# Altium schematic sheet ft600hx4k.SchDoc
size A3
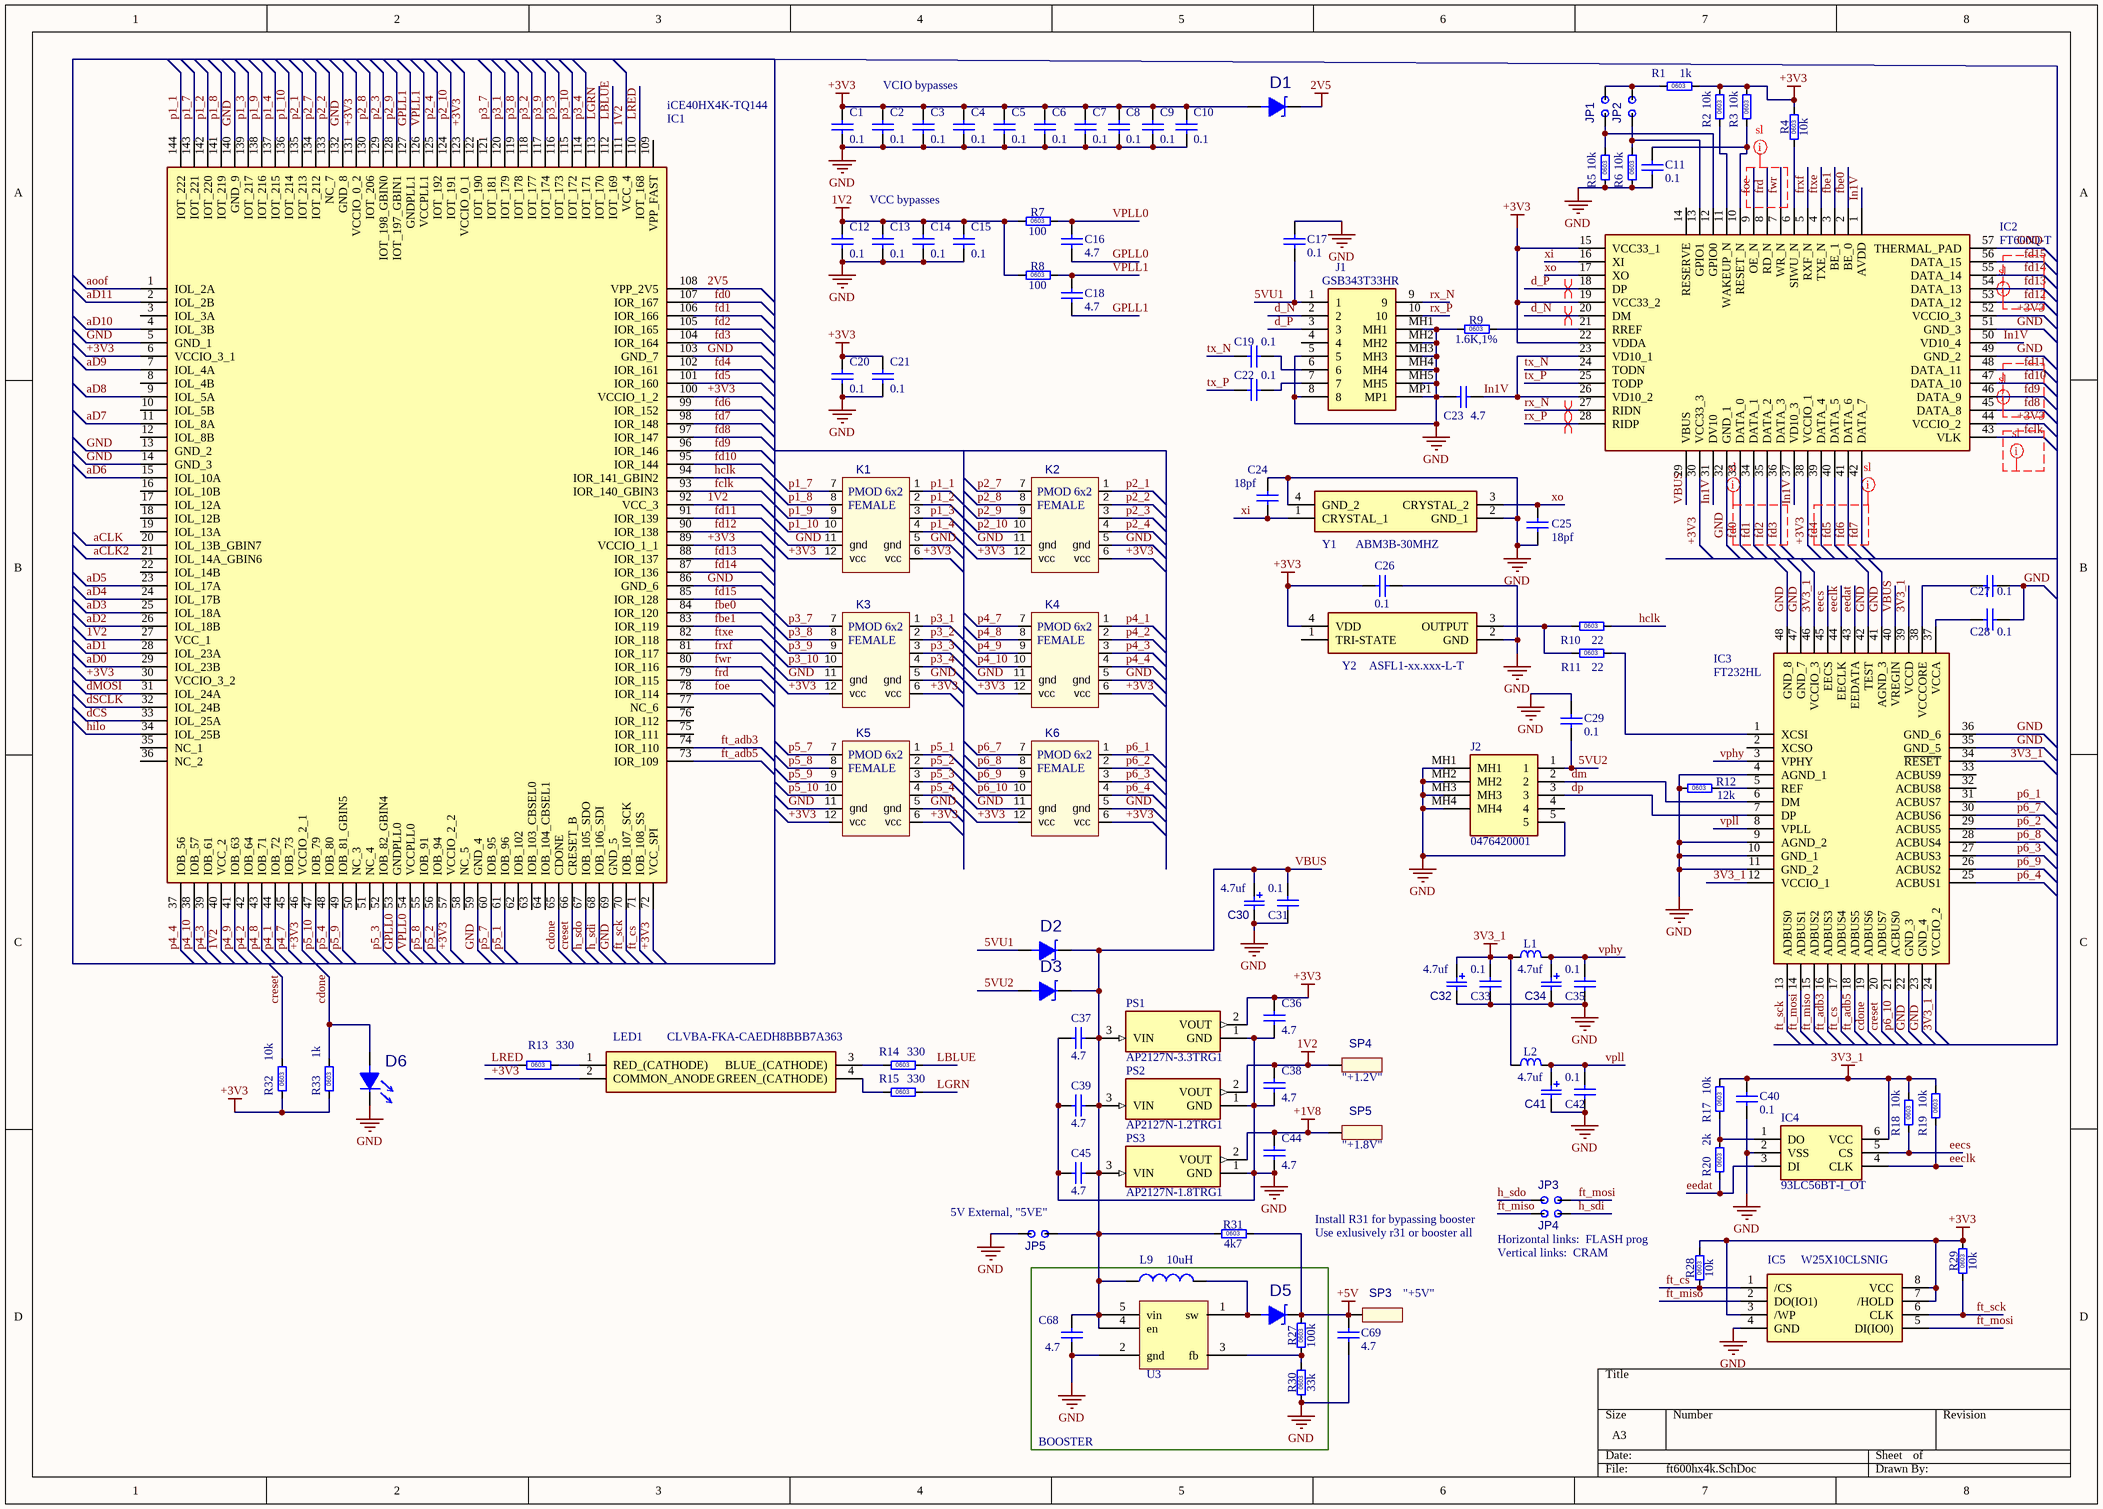
[diagram p0: ft600hx4k.SchDoc]

## Parts
C1  value 0.1  [SM0603 _3D_cap]  (hidden comment: cap0603)
C2  value 0.1  [SM0603 _3D_cap]  (hidden comment: cap0603)
C3  value 0.1  [SM0603 _3D_cap]  (hidden comment: cap0603)
C4  value 0.1  [SM0603 _3D_cap]  (hidden comment: cap0603)
C5  value 0.1  [SM0603 _3D_cap]  (hidden comment: cap0603)
C6  value 0.1  [SM0603 _3D_cap]  (hidden comment: cap0603)
C7  value 0.1  [SM0603 _3D_cap]  (hidden comment: cap0603)
C8  value 0.1  [SM0603 _3D_cap]  (hidden comment: cap0603)
C9  value 0.1  [SM0603 _3D_cap]  (hidden comment: cap0603)
C10  value 0.1  [SM0603 _3D_cap]  (hidden comment: cap0603)
C11  value 0.1  [SM0603 _3D_cap]  (hidden comment: cap0603)
C12  value 0.1  [SM0603 _3D_cap]  (hidden comment: cap0603)
C13  value 0.1  [SM0603 _3D_cap]  (hidden comment: cap0603)
C14  value 0.1  [SM0603 _3D_cap]  (hidden comment: cap0603)
C15  value 0.1  [SM0603 _3D_cap]  (hidden comment: cap0603)
C16  value 4.7  [SM0603 _3D_cap]  (hidden comment: cap0603)
C17  value 0.1  [SM0603 _3D_cap]  (hidden comment: cap0603)
C18  value 4.7  [SM0603 _3D_cap]  (hidden comment: cap0603)
C19  value 0.1  [SM0603 _3D_cap]  (hidden comment: cap0603)
C20  value 0.1  [SM0603 _3D_cap]  (hidden comment: cap0603)
C21  value 0.1  [SM0603 _3D_cap]  (hidden comment: cap0603)
C22  value 0.1  [SM0603 _3D_cap]  (hidden comment: cap0603)
C23  value 4.7  [SM0603 _3D_cap]  (hidden comment: cap0603)
C24  value 18pf  [SM0603 _3D_cap]  (hidden comment: cap0603)
C25  value 18pf  [SM0603 _3D_cap]  (hidden comment: cap0603)
C26  value 0.1  [SM0603 _3D_cap]  (hidden comment: cap0603)
C27  value 0.1  [SM0603 _3D_cap]  (hidden comment: cap0603)
C28  value 0.1  [SM0603 _3D_cap]  (hidden comment: cap0603)
C29  value 0.1  [SM0603 _3D_cap]  (hidden comment: cap0603)
C30  CAP_POL_SMA  [CAP_POL_SMA (3216)]  (value not drawn)
C31  value 0.1  [SM0603 _3D_cap]  (hidden comment: cap0603)
C32  CAP_POL_SMA  [CAP_POL_SMA (3216)]  (value not drawn)
C33  value 0.1  [SM0603 _3D_cap]  (hidden comment: cap0603)
C34  CAP_POL_SMA  [CAP_POL_SMA (3216)]  (value not drawn)
C35  value 0.1  [SM0603 _3D_cap]  (hidden comment: cap0603)
C36  value 4.7  [SM0603 _3D_cap]  (hidden comment: cap0603)
C37  value 4.7  [SM0603 _3D_cap]  (hidden comment: cap0603)
C38  value 4.7  [SM0603 _3D_cap]  (hidden comment: cap0603)
C39  value 4.7  [SM0603 _3D_cap]  (hidden comment: cap0603)
C40  value 0.1  [SM0603 _3D_cap]  (hidden comment: cap0603)
C41  CAP_POL_SMA  [CAP_POL_SMA (3216)]  (value not drawn)
C42  value 0.1  [SM0603 _3D_cap]  (hidden comment: cap0603)
C44  value 4.7  [SM0603 _3D_cap]  (hidden comment: cap0603)
C45  value 4.7  [SM0603 _3D_cap]  (hidden comment: cap0603)
C68  value 4.7  [SM0603 _3D_cap]  (hidden comment: cap0603)
C69  value 4.7  [SM0603 _3D_cap]  (hidden comment: cap0603)
D1  DiodeShottky_SOD323  [SOD323]  (value not drawn)
D2  DiodeShottky_SOD323  [SOD323]  (value not drawn)
D3  DiodeShottky_SOD323  [SOD323]  (value not drawn)
D5  DiodeShottky_SOD323  [SOD323]  (value not drawn)
D6  LIGHT_SM0805  [SM0805_diode]  (value not drawn)
IC1  iCE40HX4K-TQ144  [QFP50P2200X2200X160-144N]
IC2  FT600Q-T  [QFN40P700X700X90-57N-D]
IC3  FT232HL  [QFP50P900X900X160-48N]
IC4  93LC56BT-I_OT  [SOT95P270X145-6N]
IC5  W25X10CLSNIG  [SOIC127P600X175-8N]
J1  GSB343T33HR  [GSB343T33HR]
J2  0476420001  [0476420001]
JP1  JUMPER2  [JUMPER2]  (value not drawn)
JP2  JUMPER2  [JUMPER2]  (value not drawn)
JP3  JUMPER2  [JUMPER2]  (value not drawn)
JP4  JUMPER2  [JUMPER2]  (value not drawn)
JP5  JUMPER2  [JUMPER2]  (value not drawn)
K1  PMOD_6x2_ra_female  [PMOD_6x2_RA_FEMALE]  (value not drawn)
K2  PMOD_6x2_ra_female  [PMOD_6x2_RA_FEMALE]  (value not drawn)
K3  PMOD_6x2_ra_female  [PMOD_6x2_RA_FEMALE]  (value not drawn)
K4  PMOD_6x2_ra_female  [PMOD_6x2_RA_FEMALE]  (value not drawn)
K5  PMOD_6x2_ra_female  [PMOD_6x2_RA_FEMALE]  (value not drawn)
K6  PMOD_6x2_ra_female  [PMOD_6x2_RA_FEMALE]  (value not drawn)
L1  75R@100MHz  [SM0603_3D_res]  (value not drawn)
L2  75R@100MHz  [SM0603_3D_res]  (value not drawn)
L9  inductance SMT 3.2x4.5 mm  [inductor_LQH43PN]  (value not drawn)
LED1  CLVBA-FKA-CAEDH8BBB7A363  [CLVBAFKACAEDH8BBB7A363]
PS1  AP2127N-3.3TRG1  [SOT89P240X110-3N]
PS2  AP2127N-1.2TRG1  [SOT89P240X110-3N]
PS3  AP2127N-1.8TRG1  [SOT89P240X110-3N]
R1  1k  [SM0603_3D_res]
R2  10k  [SM0603_3D_res]
R3  10k  [SM0603_3D_res]
R4  10k  [SM0603_3D_res]
R5  10k  [SM0603_3D_res]
R6  10k  [SM0603_3D_res]
R7  100  [SM0603_3D_res]
R8  100  [SM0603_3D_res]
R9  1.6K,1%  [SM0603_3D_res]
R10  22  [SM0603_3D_res]
R11  22  [SM0603_3D_res]
R12  12k  [SM0603_3D_res]
R13  330  [SM0603_3D_res]
R14  330  [SM0603_3D_res]
R15  330  [SM0603_3D_res]
R17  10k  [SM0603_3D_res]
R18  10k  [SM0603_3D_res]
R19  10k  [SM0603_3D_res]
R20  2k  [SM0603_3D_res]
R27  100k  [SM0603_3D_res]
R28  10k  [SM0603_3D_res]
R29  10k  [SM0603_3D_res]
R30  33k  [SM0603_3D_res]
R31  4k7  [SM0603_3D_res]
R32  10k  [SM0603_3D_res]
R33  1k  [SM0603_3D_res]
SP3  value "+5V"  [SolderPad_D1mm _round]  (hidden comment: SolderPad D1mm_round)
SP4  value "+1.2V"  [SolderPad_D1mm _round]  (hidden comment: SolderPad D1mm_round)
SP5  value "+1.8V"  [SolderPad_D1mm _round]  (hidden comment: SolderPad D1mm_round)
U3  step up sot23-5  [SOT-23_5]  (value not drawn)
Y1  ABM3B-30MHZ  [ABM3B]
Y2  ASFL1-xx.xxx-L-T  [ASFL125000MHZLT]

## Blocks framed on the sheet
BOOSTER: C68 D5 L9 R27 R30 U3

## Nets
1V2: C12.2 C13.2 C14.2 C15.2 C38.1 IC1.27(VCC_1) IC1.40(VCC_2) IC1.92(VCC_3) IC1.111(VCC_4) PS2.2(VOUT) R7.1 R8.1 SP4.1
2V5: D1.2(k) IC1.108(VPP_2V5)
3V3_1: C32.1(a) C33.1 C40.2 IC3.12(VCCIO_1) IC3.24(VCCIO_2) IC3.34(~{RESET}) IC3.39(VCCD) IC3.46(VCCIO_3) IC4.6(VCC) L1.1 L2.1 R17.2 R18.2 R19.2
+1V8: C44.1 PS3.2(VOUT) SP5.1
+3V3: C1.2 C2.2 C3.2 C4.2 C5.2 C6.2 C7.2 C8.2 C9.2 C10.2 C20.2 C21.2 C26.1 C36.1 D1.1(a) IC1.6(VCCIO_3_1) IC1.30(VCCIO_3_2) IC1.46(VCCIO_2_1) IC1.57(VCCIO_2_2) IC1.72(VCC_SPI) IC1.89(VCCIO_1_1) IC1.100(VCCIO_1_2) IC1.123(VCCIO_0_1) IC1.131(VCCIO_0_2) IC2.15(VCC33_1) IC2.19(VCC33_2) IC2.22(VDDA) IC2.30(VCC33_3) IC2.38(VCCIO_1) IC2.44(VCCIO_2) IC2.52(VCCIO_3) IC5.3(/WP) IC5.7(/HOLD) IC5.8(VCC) K1.6(vcc) K1.12(vcc) K2.6(vcc) K2.12(vcc) K3.6(vcc) K3.12(vcc) K4.6(vcc) K4.12(vcc) K5.6(vcc) K5.12(vcc) K6.6(vcc) K6.12(vcc) LED1.2(COMMON_ANODE) PS1.2(VOUT) R1.2 R2.2 R3.2 R4.2 R28.2 R29.2 R32.1 R33.1 Y2.4(VDD)
+5V: C69.2 D5.2(k) R27.2 R31.2 SP3.1
GND: C1.1 C2.1 C3.1 C4.1 C5.1 C6.1 C7.1 C8.1 C9.1 C10.1 C11.2 C12.1 C13.1 C14.1 C15.1 C17.1 C20.1 C21.1 C23.2 C24.1 C25.2 C26.2 C27.2 C28.2 C29.1 C30.2(b) C31.2 C32.2(b) C33.2 C34.2(b) C35.2 C36.2 C37.2 C38.2 C39.1 C40.1 C41.2(b) C42.2 C44.2 C45.1 C68.1 C69.1 D6.2(k) IC1.5(GND_1) IC1.13(GND_2) IC1.14(GND_3) IC1.59(GND_4) IC1.69(GND_5) IC1.86(GND_6) IC1.103(GND_7) IC1.132(GND_8) IC1.140(GND_9) IC2.32(GND_1) IC2.49(GND_2) IC2.51(GND_3) IC2.57(THERMAL_PAD) IC3.4(AGND_1) IC3.9(AGND_2) IC3.10(GND_1) IC3.11(GND_2) IC3.22(GND_3) IC3.23(GND_4) IC3.35(GND_5) IC3.36(GND_6) IC3.41(AGND_3) IC3.42(TEST) IC3.47(GND_7) IC3.48(GND_8) IC4.2(VSS) IC5.4(GND) J1.5 J1.8 J1.MH1 J1.MH2 J1.MH3 J1.MH4 J1.MH5 J1.MP1 J2.5 J2.MH1 J2.MH2 J2.MH3 J2.MH4 JP5.2 K1.5(gnd) K1.11(gnd) K2.5(gnd) K2.11(gnd) K3.5(gnd) K3.11(gnd) K4.5(gnd) K4.11(gnd) K5.5(gnd) K5.11(gnd) K6.5(gnd) K6.11(gnd) PS1.1(GND) PS2.1(GND) PS3.1(GND) R5.1 R6.1 R9.1 R12.1 R30.1 U3.2(gnd) Y1.2(GND_1) Y1.4(GND_2) Y2.2(GND)
5VU1: C17.2 D2.1(a) J1.1
5VU2: C29.2 D3.1(a) J2.1
aCLK: IC1.20(IOL_13B_GBIN7)
aCLK2: IC1.21(IOL_14A_GBIN6)
aD0: IC1.29(IOL_23B)
aD1: IC1.28(IOL_23A)
aD2: IC1.26(IOL_18B)
aD3: IC1.25(IOL_18A)
aD4: IC1.24(IOL_17B)
aD5: IC1.23(IOL_17A)
aD6: IC1.15(IOL_10A)
aD7: IC1.11(IOL_8A)
aD8: IC1.9(IOL_5A)
aD9: IC1.7(IOL_4A)
aD10: IC1.4(IOL_3B)
aD11: IC1.2(IOL_2B)
aoof: IC1.1(IOL_2A)
cdone: D6.1(a) IC1.65(CDONE) IC3.19(ADBUS6) R33.2
creset: IC1.66(CRESET_B) IC3.20(ADBUS7) R32.2
d_N: IC2.20(DM) J1.2
d_P: IC2.18(DP) J1.3
dCS: IC1.33(IOL_25A)
dm: IC3.6(DM) J2.2
dMOSI: IC1.31(IOL_24A)
dp: IC3.7(DP) J2.3
dSCLK: IC1.32(IOL_24B)
eeclk: IC3.44(EECLK) IC4.4(CLK) R19.1
eecs: IC3.45(EECS) IC4.5(CS) R18.1
eedat: IC3.43(EEDATA) IC4.3(DI) R20.1
fbe0: IC1.84(IOR_120) IC2.2(BE_0)
fbe1: IC1.83(IOR_119) IC2.3(BE_1)
fclk: IC1.93(IOR_140_GBIN3) IC2.43(VLK)
fd0: IC1.107(IOR_167) IC2.33(DATA_0)
fd1: IC1.106(IOR_166) IC2.34(DATA_1)
fd2: IC1.105(IOR_165) IC2.35(DATA_2)
fd3: IC1.104(IOR_164) IC2.36(DATA_3)
fd4: IC1.102(IOR_161) IC2.39(DATA_4)
fd5: IC1.101(IOR_160) IC2.40(DATA_5)
fd6: IC1.99(IOR_152) IC2.41(DATA_6)
fd7: IC1.98(IOR_148) IC2.42(DATA_7)
fd8: IC1.97(IOR_147) IC2.45(DATA_8)
fd9: IC1.96(IOR_146) IC2.46(DATA_9)
fd10: IC1.95(IOR_144) IC2.47(DATA_10)
fd11: IC1.91(IOR_139) IC2.48(DATA_11)
fd12: IC1.90(IOR_138) IC2.53(DATA_12)
fd13: IC1.88(IOR_137) IC2.54(DATA_13)
fd14: IC1.87(IOR_136) IC2.55(DATA_14)
fd15: IC1.85(IOR_128) IC2.56(DATA_15)
foe: IC1.78(IOR_114) IC2.9(OE_N)
frd: IC1.79(IOR_115) IC2.8(RD_N)
frxf: IC1.81(IOR_117) IC2.5(RXF_N)
ft_adb3: IC1.74(IOR_110) IC3.16(ADBUS3)
ft_adb5: IC1.73(IOR_109) IC3.18(ADBUS5)
ft_cs: IC1.71(IOB_108_SS) IC3.17(ADBUS4) IC5.1(/CS) R28.1
ft_miso: IC3.15(ADBUS2) IC5.2(DO(IO1)) JP4.2
ft_mosi: IC3.14(ADBUS1) IC5.5(DI(IO0)) JP3.1
ft_sck: IC1.70(IOB_107_SCK) IC3.13(ADBUS0) IC5.6(CLK) R29.1
ftxe: IC1.82(IOR_118) IC2.4(TXE_N)
fwr: IC1.80(IOR_116) IC2.7(WR_N)
GPLL0: C16.2 IC1.53(GNDPLL0)
GPLL1: C18.2 IC1.127(GNDPLL1)
h_sdi: IC1.68(IOB_106_SDI) JP4.1
h_sdo: IC1.67(IOB_105_SDO) JP3.2
hclk: IC1.94(IOR_141_GBIN2) R10.2
hilo: IC1.34(IOL_25B)
In1V: C23.1 IC2.1(AVDD) IC2.23(VD10_1) IC2.26(VD10_2) IC2.31(DV10) IC2.37(VD10_3) IC2.50(VD10_4)
LBLUE: IC1.112(IOT_169) R14.2
LGRN: IC1.113(IOT_170) R15.2
LRED: IC1.110(IOT_168) R13.1
p1_1: IC1.144(IOT_222) K1.1
p1_2: IC1.142(IOT_220) K1.2
p1_3: IC1.139(IOT_217) K1.3
p1_4: IC1.137(IOT_215) K1.4
p1_7: IC1.143(IOT_221) K1.7
p1_8: IC1.141(IOT_219) K1.8
p1_9: IC1.138(IOT_216) K1.9
p1_10: IC1.136(IOT_214) K1.10
p2_1: IC1.135(IOT_213) K2.1
p2_2: IC1.133(NC_7) K2.2
p2_3: IC1.129(IOT_198_GBIN0) K2.3
p2_4: IC1.125(IOT_192) K2.4
p2_7: IC1.134(IOT_212) K2.7
p2_8: IC1.130(IOT_206) K2.8
p2_9: IC1.128(IOT_197_GBIN1) K2.9
p2_10: IC1.124(IOT_191) K2.10
p3_1: IC1.120(IOT_179) K3.1
p3_2: IC1.118(IOT_177) K3.2
p3_3: IC1.116(IOT_173) K3.3
p3_4: IC1.114(IOT_171) K3.4
p3_7: IC1.121(IOT_181) K3.7
p3_8: IC1.119(IOT_178) K3.8
p3_9: IC1.117(IOT_174) K3.9
p3_10: IC1.115(IOT_172) K3.10
p4_1: IC1.44(IOB_72) K4.1
p4_2: IC1.42(IOB_64) K4.2
p4_3: IC1.39(IOB_61) K4.3
p4_4: IC1.37(IOB_56) K4.4
p4_7: IC1.45(IOB_73) K4.7
p4_8: IC1.43(IOB_71) K4.8
p4_9: IC1.41(IOB_63) K4.9
p4_10: IC1.38(IOB_57) K4.10
p5_1: IC1.61(IOB_96) K5.1
p5_2: IC1.56(IOB_94) K5.2
p5_3: IC1.52(IOB_82_GBIN4) K5.3
p5_4: IC1.48(IOB_80) K5.4
p5_7: IC1.60(IOB_95) K5.7
p5_8: IC1.55(IOB_91) K5.8
p5_9: IC1.49(IOB_81_GBIN5) K5.9
p5_10: IC1.47(IOB_79) K5.10
p6_1: IC3.31(ACBUS7) K6.1
p6_2: IC3.29(ACBUS5) K6.2
p6_3: IC3.27(ACBUS3) K6.3
p6_4: IC3.25(ACBUS1) K6.4
p6_7: IC3.30(ACBUS6) K6.7
p6_8: IC3.28(ACBUS4) K6.8
p6_9: IC3.26(ACBUS2) K6.9
p6_10: IC3.21(ACBUS0) K6.10
rx_N: IC2.27(RIDN) J1.9
rx_P: IC2.28(RIDP) J1.10
tx_N: C19.2 IC2.24(TODN)
tx_P: C22.2 IC2.25(TODP)
VBUS: C30.1(a) C31.1 C37.1 C39.2 C45.2 C68.2 D2.2(k) D3.2(k) IC2.29(VBUS) IC3.40(VREGIN) JP5.1 L9.1 PS1.3(VIN) PS2.3(VIN) PS3.3(VIN) R31.1 U3.4(en) U3.5(vin)
vphy: C34.1(a) C35.1 IC3.3(VPHY) L1.2
vpll: C41.1(a) C42.1 IC3.8(VPLL) L2.2
VPLL0: C16.1 IC1.54(VCCPLL0) R7.2
VPLL1: C18.1 IC1.126(VCCPLL1) R8.2
xi: C24.2 IC2.16(XI) Y1.1(CRYSTAL_1)
xo: C25.1 IC2.17(XO) Y1.3(CRYSTAL_2)
NetC11_1: C11.1 IC2.10(RESET_N) R3.1
NetC19_1: C19.1 J1.6
NetC22_1: C22.1 J1.7
NetC27_1: C27.1 IC3.38(VCCCORE)
NetC28_1: C28.1 IC3.37(VCCA)
NetD5_1: D5.1(a) L9.2 U3.1(sw)
NetIC2_6: IC2.6(SIWU_N) R4.1
NetIC2_11: IC2.11(WAKEUP_N) R2.1
NetIC2_12: IC2.12(GPIO0) JP1.2 R5.2
NetIC2_13: IC2.13(GPIO1) JP2.2 R6.2
NetIC2_21: IC2.21(RREF) R9.2
NetIC3_1: IC3.1(XCSI) R11.2
NetIC3_5: IC3.5(REF) R12.2
NetIC4_1: IC4.1(DO) R17.1 R20.2
NetJP1_1: JP1.1 JP2.1 R1.1
NetLED1_1: LED1.1(RED_(CATHODE)) R13.2
NetLED1_3: LED1.3(BLUE_(CATHODE)) R14.1
NetLED1_4: LED1.4(GREEN_(CATHODE)) R15.1
NetR10_1: R10.1 R11.1 Y2.3(OUTPUT)
NetR27_1: R27.1 R30.2 U3.3(fb)

Not connected (* = marked no-connect by the designer): IC1 3(IOL_3A) 8(IOL_4B) 10(IOL_5B) 12(IOL_8B) 16(IOL_10B) 17(IOL_12A) 18(IOL_12B) 19(IOL_13A) 22(IOL_14B) 35(NC_1) 36(NC_2) 50(NC_3) 51(NC_4) 58(NC_5) 62(IOB_102) 63(IOB_103_CBSEL0) 64(IOB_104_CBSEL1) 75(IOR_111) 76(IOR_112) 77(NC_6) 109(VPP_FAST) 122(IOT_190); IC2 14(RESERVE); IC3 2(XCSO) 32(ACBUS8) 33(ACBUS9); J1 4; J2 4; Y2 1(TRI-STATE)

## Layout directives
differential pair: d_N, d_P, rx_N, rx_P
rule Matched Net Lengths [Tolerance = 20mil]; net class ft: fclk, fd0, fd1, fd2, fd3, fd4, fd5, fd6, fd7, fd8, fd9, fd10, fd11, fd12, fd13, fd14, fd15, foe, frd, fwr

## Notes on the sheet
- VCIO bypasses
- VCC bypasses
- (near JP5) 5V External, "5VE"
- Install R31 for bypassing booster
- Use exlusively r31 or booster all
- Horizontal links:  FLASH prog
- Vertical links:  CRAM
- (in symbol CAP_POL_SMA) 4.7uf
- (in symbol inductor_LQH43PN) 10uH
- (in symbol PMOD_6x2_ra_female) PMOD 6x2; FEMALE
- (in symbol Res_0603_EU) 0603

## Library data of the parts
C1-C29 C31 C33 C35-C40 C42 C44 C45 C68 C69 = cap0603: Capacitor  0603 inch; Published: 8-Jun-2000; LatestRevisionDate: 17-Jul-2002; LatestRevisionNote: Re-released for DXP Platform.; PackageReference: RAD-0.3; Publisher: Altium Limited; PackageDescription: Radial Cap, Thru-Hole; 2 Leads; 0.3 in Pin Spacing
C30 C32 C34 C41 = CAP_POL_SMA: CAP_POL_SMA(3216)
D1-D3 D5 = DiodeShottky_SOD323: SOD323
IC1 = iCE40HX4K-TQ144: Integrated Circuit; Manufacturer_Name: Lattice Semiconductor; Datasheet Link: https://componentsearchengine.com/Datasheets/1/iCE40HX4K-TQ144.pdf; Height: 1.6mm; Manufacturer_Part_Number: iCE40HX4K-TQ144; Mouser Part Number: 842-ICE40HX4K-TQ144; Mouser Price/Stock: https://www.mouser.co.uk/ProductDetail/Lattice/iCE40HX4K-TQ144?qs=F9A14TELRMvGNTZXkNDuOw%3D%3D; Arrow Part Number: ICE40HX4K-TQ144; Arrow Price/Stock: https://www.arrow.com/en/products/ice40hx4k-tq144/lattice-semiconductor
IC2 = FT600Q-T: Integrated Circuit; Manufacturer_Name: FTDI Chip; Datasheet Link: http://www.farnell.com/datasheets/1975744.pdf; Height: 0.9mm; Manufacturer_Part_Number: FT600Q-T; Mouser Part Number: 895-FT600Q-T; Mouser Price/Stock: https://www.mouser.com/Search/Refine.aspx?Keyword=895-FT600Q-T; Arrow Part Number: FT600Q-T; Arrow Price/Stock: https://www.arrow.com/en/products/ft600q-t/ftdi-chip
IC3 = FT232HL-REEL: Integrated Circuit; Manufacturer_Name: FTDI Chip; Datasheet Link: http://www.ftdichip.com/Support/Documents/DataSheets/ICs/DS_FT232H.pdf; Height: 1.6mm; Manufacturer_Part_Number: FT232HL-REEL; Mouser Part Number: 895-FT232HL-REEL; Mouser Price/Stock: https://www.mouser.co.uk/ProductDetail/FTDI/FT232HL-REEL/?qs=rzPzygjq8vIanTFlYsBQCw%3D%3D; Arrow Part Number: FT232HL-REEL; Arrow Price/Stock: https://www.arrow.com/en/products/ft232hl-reel/ftdi-chip
IC4 = 93LC56BT-I_OT: Integrated Circuit; Manufacturer_Name: Microchip; Manufacturer_Part_Number: 93LC56BT-I/OT; Datasheet Link: http://ww1.microchip.com/downloads/en/DeviceDoc/21794G.pdf; Height: 1.45mm; Mouser Part Number: 579-93LC56BT-I/OT; Mouser Price/Stock: https://www.mouser.co.uk/ProductDetail/Microchip-Technology/93LC56BT-I-OT?qs=lQv0JY93vrc7B5Rh5LPW8g%3D%3D; Arrow Part Number: 93LC56BT-I/OT; Arrow Price/Stock: https://www.arrow.com/en/products/93lc56bt-iot/microchip-technology?region=nac
IC5 = W25X10CLSNIG: Integrated Circuit; Manufacturer_Name: Winbond; Datasheet Link: https://www.arrow.com/en/products/w25x10clsnig/winbond-electronics; Height: 1.75mm; Manufacturer_Part_Number: W25X10CLSNIG; Mouser Part Number: 454-W25X10CLSNIG; Mouser Price/Stock: https://www.mouser.co.uk/ProductDetail/Winbond/W25X10CLSNIG?qs=qSfuJ%252Bfl%2Fd58%252Bc3wxS8Vmg%3D%3D; Arrow Part Number: W25X10CLSNIG; Arrow Price/Stock: https://www.arrow.com/en/products/w25x10clsnig/winbond-electronics
J1 = GSB343T33HR: Connector; Manufacturer_Name: Amphenol; Datasheet Link: https://componentsearchengine.com/Datasheets/2/GSB343T33HR.pdf; Height: 5.25mm; Manufacturer_Part_Number: GSB343T33HR; Mouser Part Number: 523-GSB343T33HR; Mouser Price/Stock: https://www.mouser.co.uk/ProductDetail/Amphenol-Commercial-Products/GSB343T33HR/?qs=8nwx9VzGl4wjI7K6xpTSyQ%3D%3D; Arrow Part Number: GSB343T33HR; Arrow Price/Stock: https://www.arrow.com/en/products/gsb343t33hr/amphenol
J2 = 0476420001: Connector; Manufacturer_Name: Molex; Datasheet Link: https://www.molex.com/pdm_docs/sd/476420001_sd.pdf; Height: 2.94mm; Manufacturer_Part_Number: 0476420001; Mouser Part Number: N/A; Mouser Price/Stock: https://www.mouser.com/Search/Refine.aspx?Keyword=N%2FA; Arrow Part Number: 0476420001; Arrow Price/Stock: https://www.arrow.com/en/products/0476420001/molex?region=nac
K1-K6 = PMOD_6x2_ra_female: PMOD_6x2_right_angle; Value: *
L1 L2 = chip inductance 0603: Part Number: IND0805_MURATA_BLM21BB750SN1D; Part Description: SMD EMIFIL Suppression Chip Ferrite Bead; Manufacturer: MURATA; Manufacturer Part Number: BLM21BB750SN1D; Power: 700mA; Resistance: 0.16R; Tolerance: ±25%; Table: Inductors SMD; Component Kind: Standard; Component Type: Standard; Footprint: INDC2012X105N; Pin Count: 2; Value: 75R@100MHz; Status: None; Case: 0805; Mounted: Yes; Socket: No; SMD: Yes; ComponentHeight: 1.05mm; Author: S. Jafar; CreateDate: 12/21/2015; LatestRevisionDate: 12/21/2015
L9 = inductor_LQH43PN
LED1 = CLVBA-FKA-CAEDH8BBB7A363: LED; Manufacturer_Name: Cree; Datasheet Link: http://www.cree.com/led-components/media/documents/ds-CLVBA-FKA.pdf; Height: 2.1mm; Manufacturer_Part_Number: CLVBA-FKA-CAEDH8BBB7A363; Mouser Part Number: 941-VBAFKACAEDH8B7A3; Mouser Price/Stock: https://www.mouser.co.uk/ProductDetail/Cree-Inc/CLVBA-FKA-CAEDH8BBB7a363/?qs=3AcK5DacLboXYkg4biCgSA%3D%3D; Arrow Part Number: CLVBA-FKA-CAEDH8BBB7A363; Arrow Price/Stock: https://www.arrow.com/en/products/clvba-fka-caedh8bbb7a363/cree
PS1-PS3 = AP2127N-3.3TRG1: Power Supply; Manufacturer_Name: Diodes Inc.; Datasheet Link: https://componentsearchengine.com/Datasheets/1/AP2127N-3.3TRG1.pdf; Height: 1.1mm; Manufacturer_Part_Number: AP2127N-3.3TRG1; Mouser Part Number: 621-AP2127N-3.3TRG1; Mouser Price/Stock: https://www.mouser.co.uk/ProductDetail/Diodes-Incorporated/AP2127N-33TRG1/?qs=x6A8l6qLYDCwIat%252BGHxAAg%3D%3D; Arrow Part Number: AP2127N-3.3TRG1; Arrow Price/Stock: https://www.arrow.com/en/products/ap2127n-3.3trg1/diodes-incorporated
R1-R8 R10-R15 R17-R20 R27-R30 R32 R33 = Res_0603_EU: Part Number: R1206_4K7_1%_0.25W_100PPM; Part Description: General Purpose Thick Film Chip Resistor; Manufacturer: GENERIC; Manufacturer1 Part Number: NRC12F4701TRF; Value: 4k7; Power: 0.25W; TC: ±100ppm/°C; Tolerance: ±1%; Table: Resistors SMD; Component Kind: Standard; Component Type: Standard; Footprint: RESC3216X65N; Pin Count: 2; Status: Preferred; Manufacturer Part Number: R1206_4K7_1%_0.25W_100PPM; Case: 1206; Mounted: Yes; Socket: No; SMD: Yes; Manufacturer1 Example: NIC COMPONENT; Manufacturer1 ComponentHeight: 0.65mm; HelpURL: \\cern.ch\dfs\Applications\Altium\Datasheets\R1206_NIC_NRC.pdf; Author: CERN DEM JLC; CreateDate: 12/3/2007; LatestRevisionDate: 3/13/2008
R9 = Res_0603_EU: Part Number: R1206_4K7_1%_0.25W_100PPM; Part Description: General Purpose Thick Film Chip Resistor; Manufacturer: GENERIC; Manufacturer1 Part Number: NRC12F4701TRF; Value: 4k7; Power: 0.25W; TC: ±100ppm/°C; Table: Resistors SMD; Component Kind: Standard; Component Type: Standard; Footprint: RESC3216X65N; Pin Count: 2; Status: Preferred; Tolerance: ±1%; Manufacturer Part Number: R1206_4K7_1%_0.25W_100PPM; Case: 1206; Mounted: Yes; Socket: No; SMD: Yes; Manufacturer1 Example: NIC COMPONENT; Manufacturer1 ComponentHeight: 0.65mm; HelpURL: \\cern.ch\dfs\Applications\Altium\Datasheets\R1206_NIC_NRC.pdf; Author: CERN DEM JLC; CreateDate: 12/3/2007; LatestRevisionDate: 3/13/2008
R31 = Res_0603_EU: Part Number: R1206_4K7_1%_0.25W_100PPM; Part Description: General Purpose Thick Film Chip Resistor; Manufacturer: GENERIC; Manufacturer1 Part Number: NRC12F4701TRF; Power: 0.25W; TC: ±100ppm/°C; Tolerance: ±1%; Table: Resistors SMD; Component Kind: Standard; Component Type: Standard; Footprint: RESC3216X65N; Pin Count: 2; Value: 4k7; Status: Preferred; Manufacturer Part Number: R1206_4K7_1%_0.25W_100PPM; Case: 1206; Mounted: Yes; Socket: No; SMD: Yes; Manufacturer1 Example: NIC COMPONENT; Manufacturer1 ComponentHeight: 0.65mm; HelpURL: \\cern.ch\dfs\Applications\Altium\Datasheets\R1206_NIC_NRC.pdf; Author: CERN DEM JLC; CreateDate: 12/3/2007; LatestRevisionDate: 3/13/2008
SP3-SP5 = SolderPad D1mm_round: for finger touch
U3 = TPS61040
Y1 = ABM3B-11.0592MHZ-10-1-U-T: Crystal or Oscillator; Manufacturer_Name: ABRACON; Datasheet Link: https://abracon.com/Resonators/abm3b.pdf; Manufacturer_Part_Number: ABM3B-11.0592MHZ-10-1-U-T; Mouser Part Number: 815-ABM3B-11.0592-T; Mouser Price/Stock: https://www.mouser.co.uk/ProductDetail/ABRACON/ABM3B-110592MHZ-10-1-U-T?qs=LMMkZCEv%2Ff1YUX89OuYUdg%3D%3D; Arrow Part Number: ABM3B-11.0592MHZ-10-1-U-T; Arrow Price/Stock: https://www.arrow.com/en/products/abm3b-11.0592mhz-10-1-u-t/abracon
Y2 = ASFL1-25.000MHZ-L-T: Crystal or Oscillator; Manufacturer_Name: ABRACON; Datasheet Link: https://componentsearchengine.com/Datasheets/1/ASFL1-25.000MHZ-L-T.pdf; Height: 1.3mm; Manufacturer_Part_Number: ASFL1-25.000MHZ-L-T; Mouser Part Number: 815-ASFL1-25-L-T; Mouser Price/Stock: https://www.mouser.co.uk/ProductDetail/ABRACON/ASFL1-25000MHZ-L-T?qs=jv7ULIbIBgOiRkeuuil%252BKg%3D%3D; Arrow Part Number: ASFL1-25.000MHZ-L-T; Arrow Price/Stock: https://www.arrow.com/en/products/asfl1-25.000mhz-l-t/abracon
D6 = LIGHT_SM0805: Value: *
JP1-JP5 = JUMPER2: Value: *